# Altium project Muladhara_PCB.PrjPcb
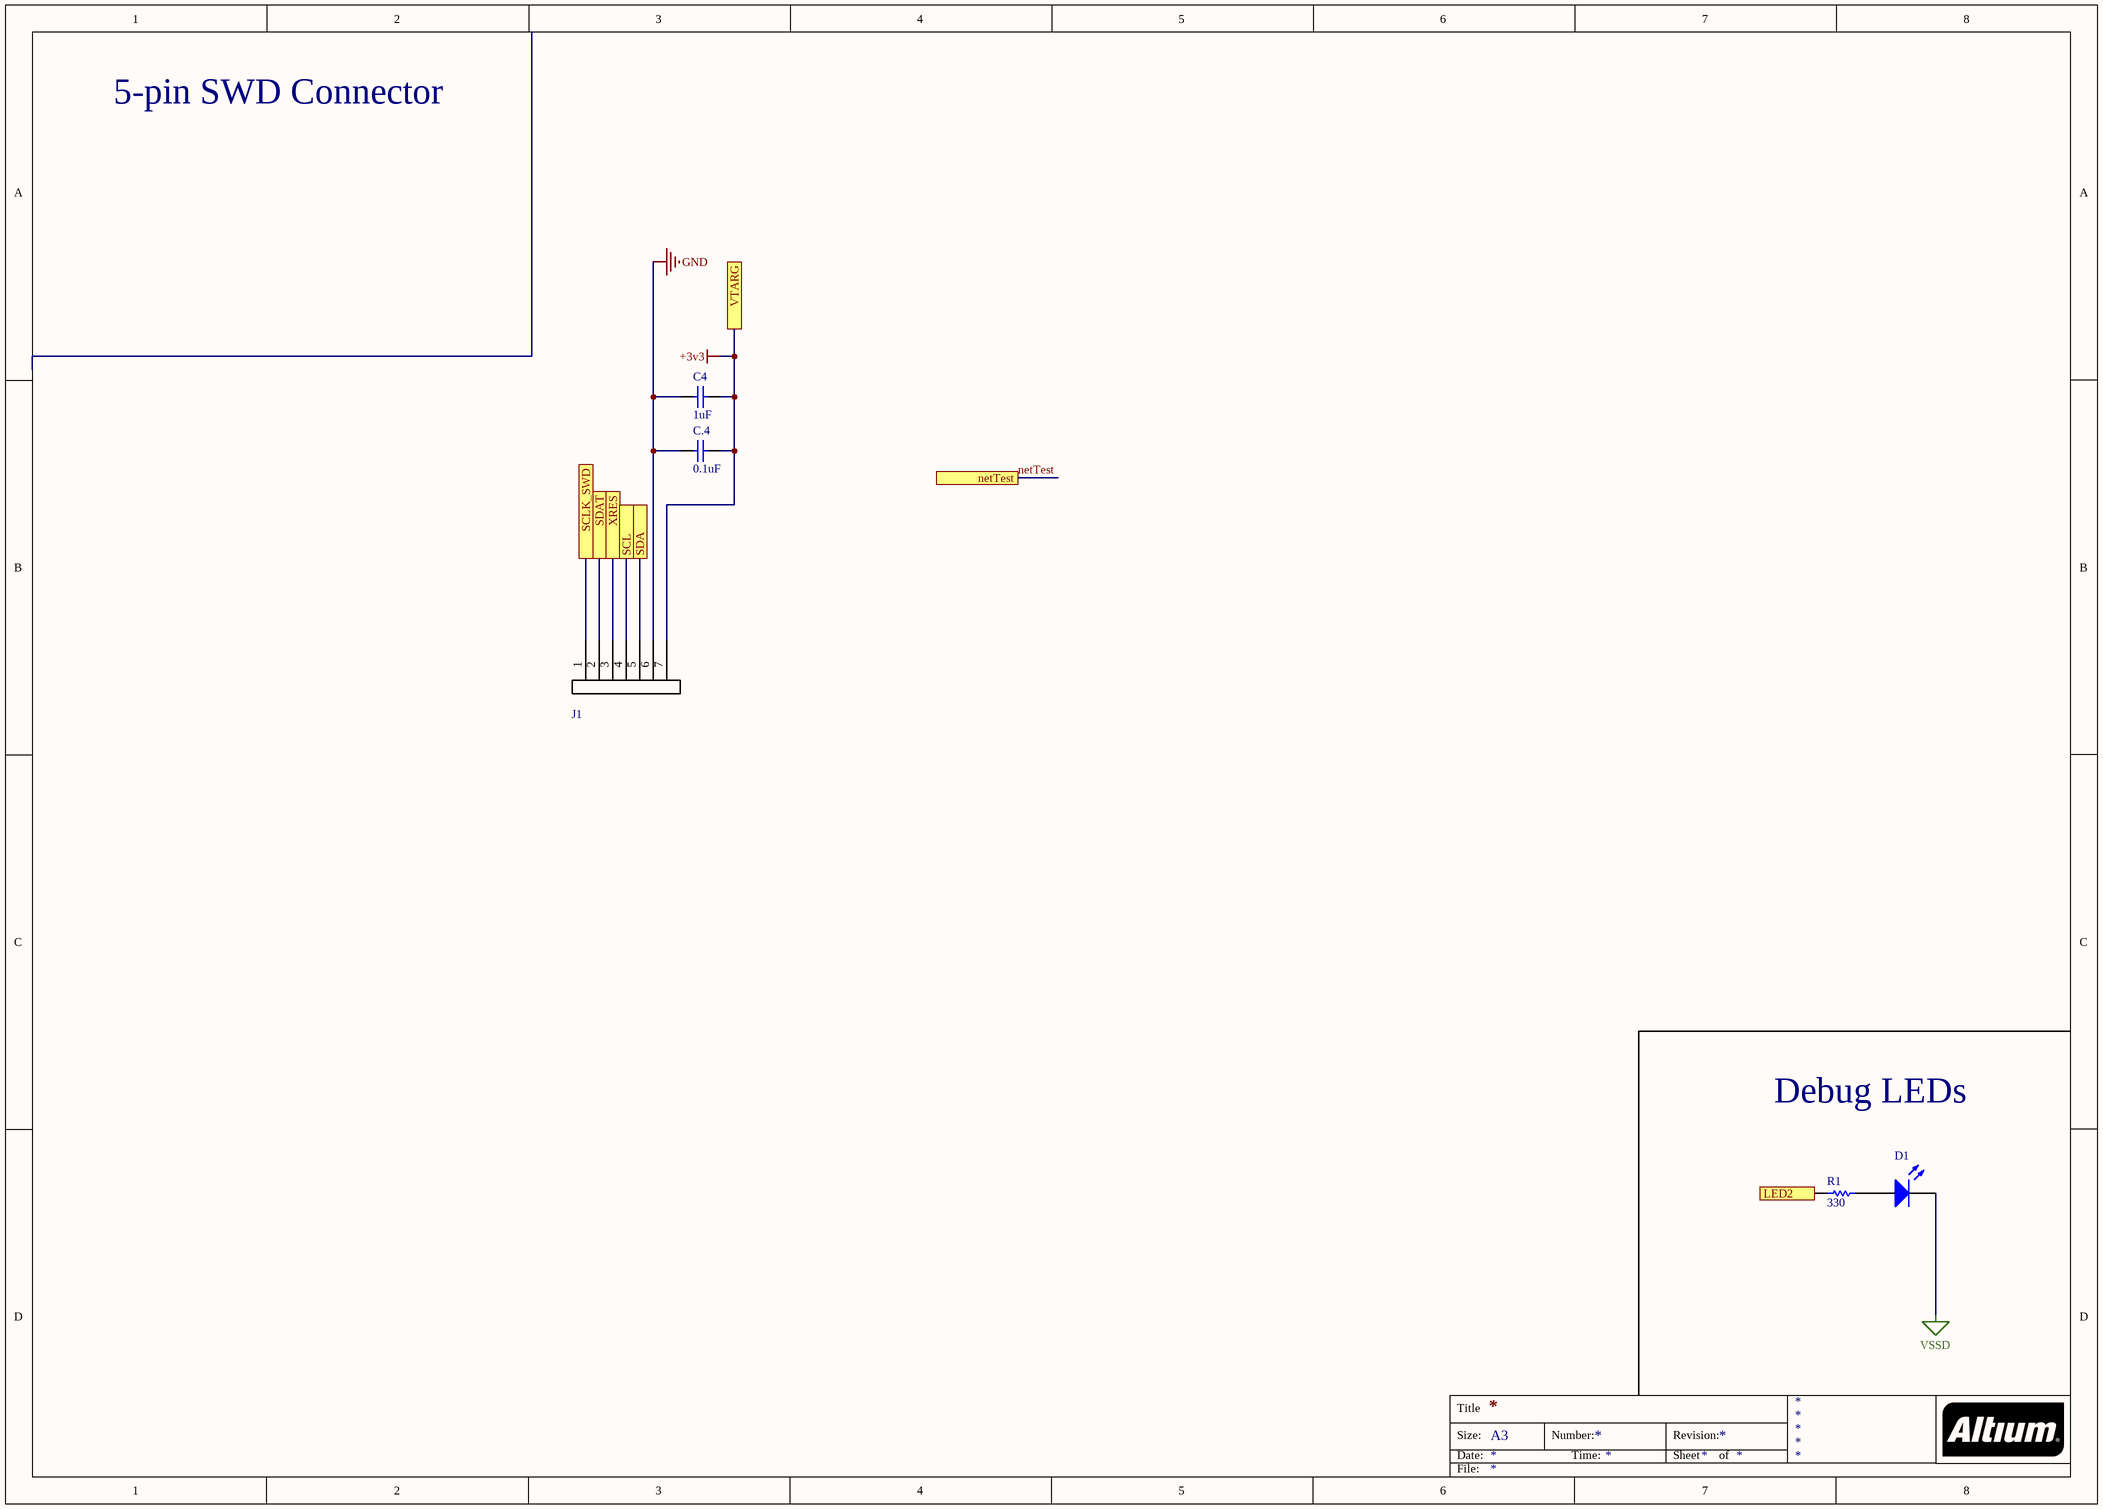
[diagram p0: Comm.SchDoc]
4 sheets, 35 parts. Net scope: flat (ports and power ports of the same name join across sheets).
Board file: Muladhara_Circuit.PcbDoc
Sheets:
  Comm.SchDoc
  CSX_Capsense.SchDoc
  CY8C4125AZI-S433.SchDoc
  Power.SchDoc

## Sheet Comm.SchDoc
size A3

### Parts
C4  1uF  [CAPC0603(1608)100_N]
C.4  0.1uF  [CAPC0603(1608)100_N]
D1  150060BS75000  [0603_A]  (value not drawn)
J1  BM07B-NSHSS-TBT (LF)(SN)  [BM07B-NSHSS-TBT (LF)(SN)]  (value not drawn)
R1  330  [RESC0603(1608)_L]

### Ports
LED2 (in), netTest, SCL, SCLK_SWD, SDA, SDAT, VTARG, XRES

### Nets
+3v3: C4.1 C.4.1 J1.7 ; port VTARG
GND: C4.2 C.4.2 J1.6
VSSD: D1.1(K)
LED2: R1.1 ; port LED2
netTest: port netTest
SCL: J1.4 ; port SCL
SCLK_SWD: J1.1 ; port SCLK_SWD
SDA: J1.5 ; port SDA
SDAT: J1.2 ; port SDAT
XRES: J1.3 ; port XRES
NetD1_2: D1.2(A) R1.2

### Notes on the sheet
- 5-pin SWD Connector
- Debug LEDs
- Title
- Size:
- Date:
- A3
- Number:
- Time:
- Revision:
- Sheet
- of
- File:

### Library data of the parts
C4 = CMP-1035-02746-1: CAP 1uF 50V ±20% 0603 (1608 Metric) Thickness 1mm SMD; Tolerance: Â±20%; Case-EIA: 0603; Case-Metric: 1608; Value: 1uF; Technology: SMT; Max Thickness: 1 mm; Rated Voltage: 50 V
C.4 = CMP-1035-02746-1: CAP 0.1 uF 50V ±20% 0603 (1608 Metric) Thickness 1mm SMD; Tolerance: Â±20%; Value: 1uF; Case-EIA: 0603; Case-Metric: 1608; Technology: SMT; Max Thickness: 1 mm; Rated Voltage: 50 V
D1 = CMP-1426-00003-1: SMD mono-color Chip LED, WL-SMCW, Blue; Manufacturer: Wuerth Elektronik; Color: Blue; ComponentLink2Description: Datasheet; ComponentLink2URL: http://katalog.we-online.com/led/datasheet/150060BS75000.pdf; ComponentLink1URL: http://www.we-online.com; PackageReference: 0603_A; PartNumber: 150060BS75000; ComponentLink1Description: Manufacturer URL
R1 = CMP-1012-00062-1: 330R 0.1W 5% 0603 (1608 Metric)  SMD; Value: 330.00 Ohm; Case-EIA: 0603; Case-Metric: 1608; Tolerance: 5 %; Power: 0.1 W; Technology: SMT

## Sheet CSX_Capsense.SchDoc
size A3
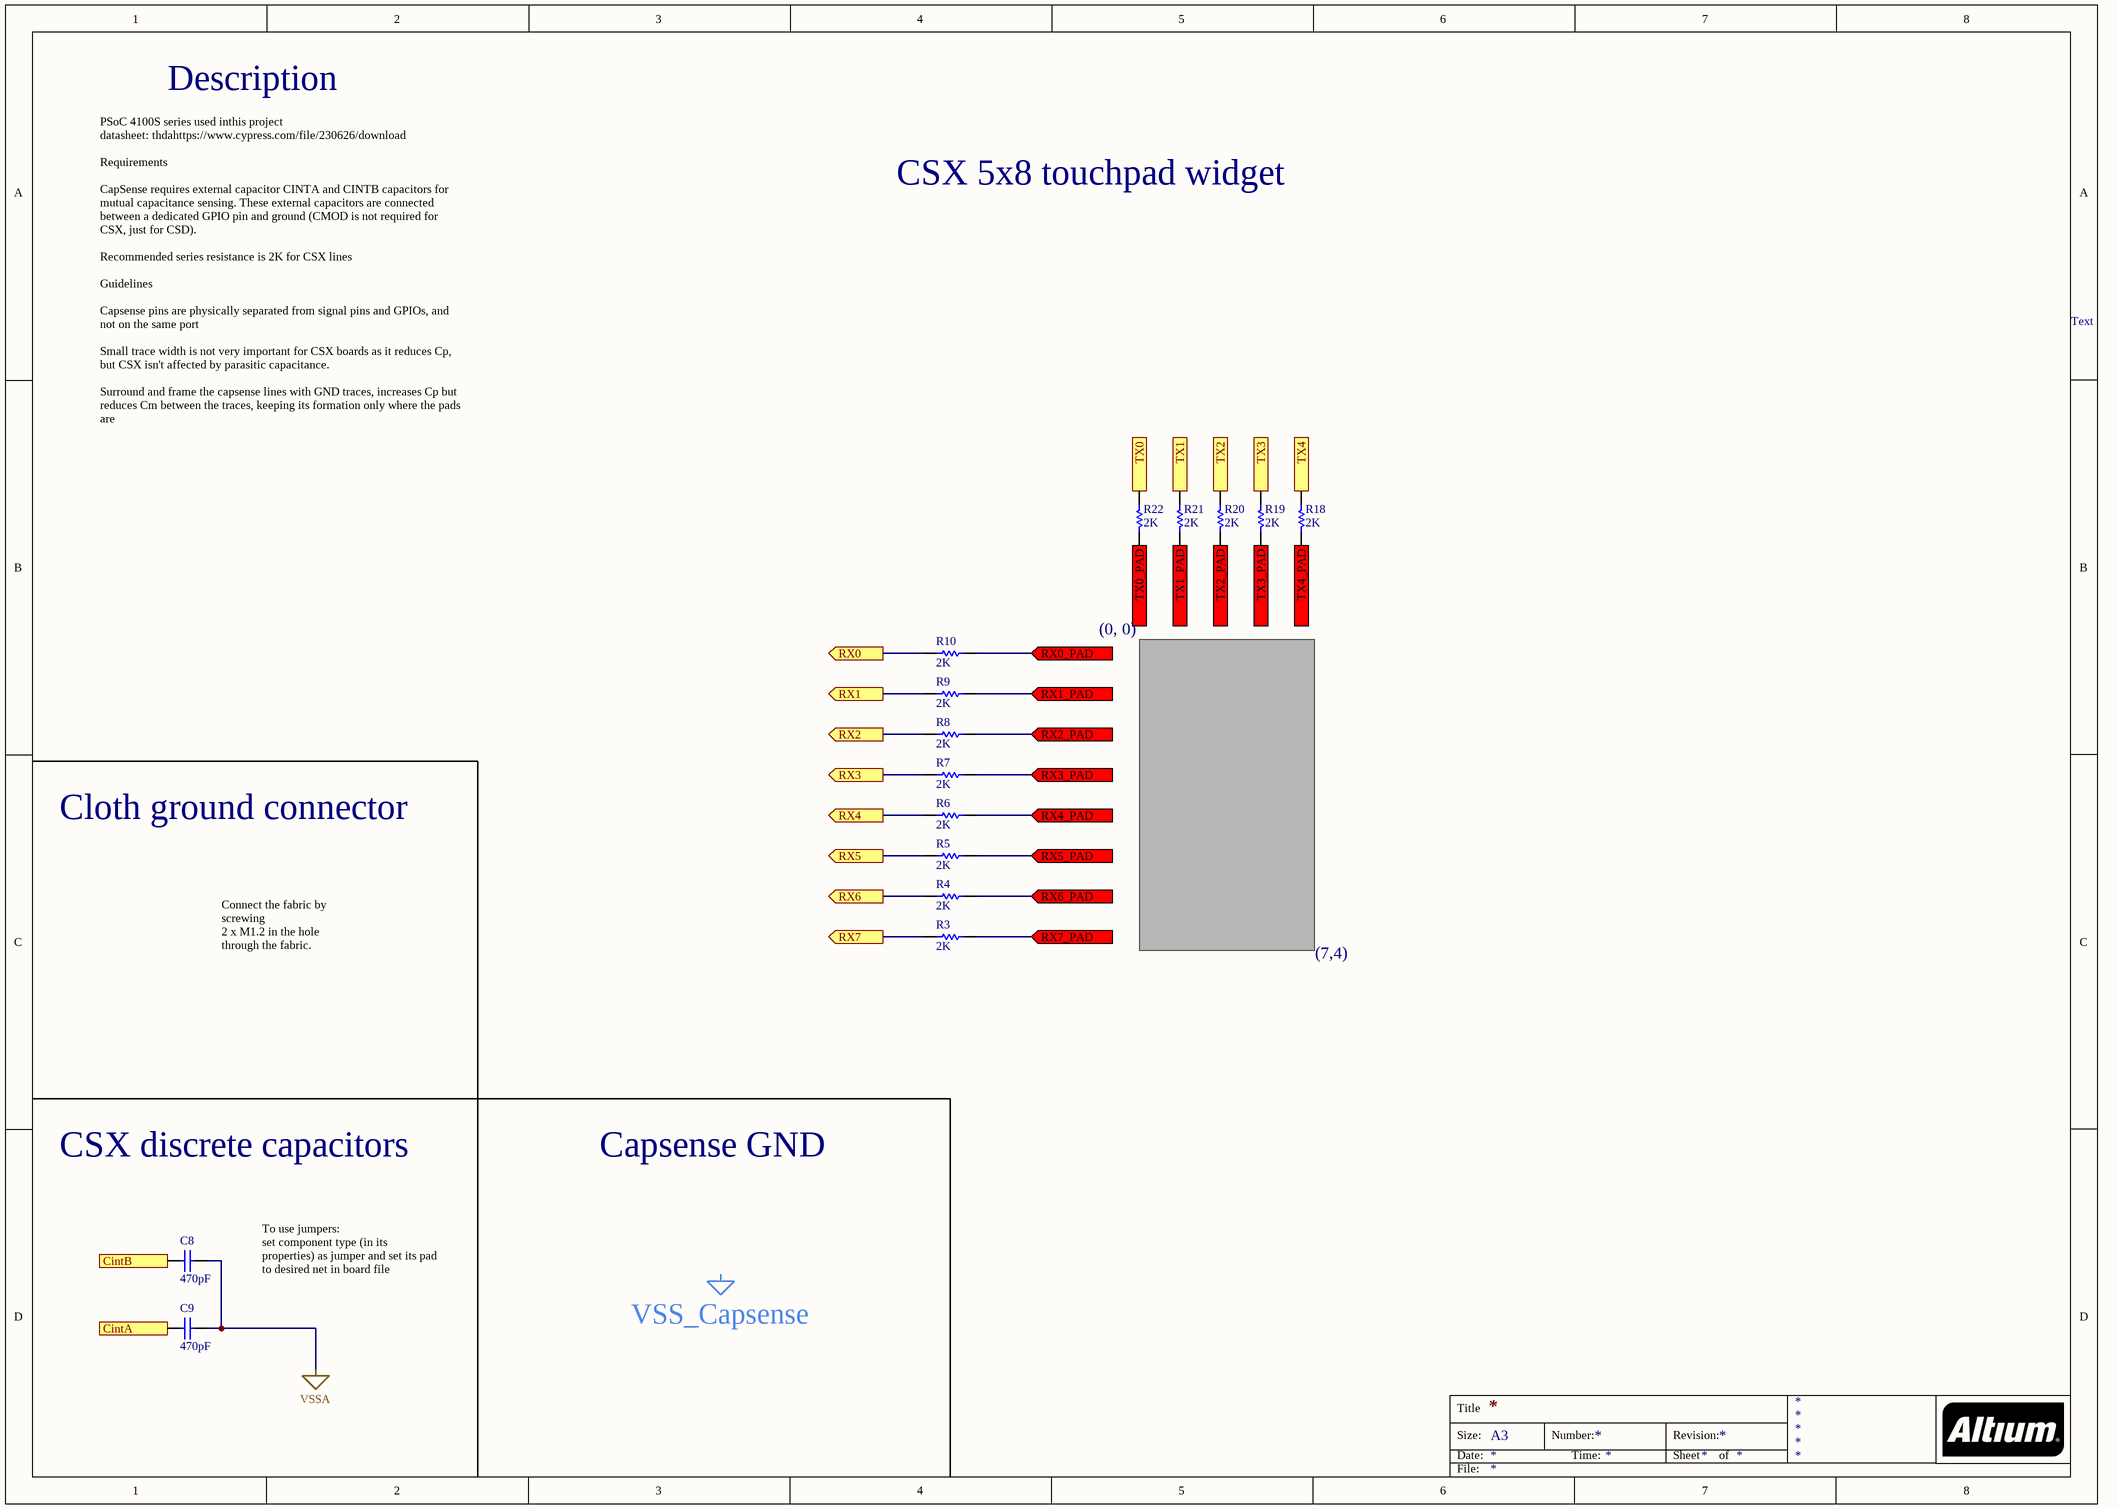
[diagram p1: CSX_Capsense.SchDoc]

### Parts
C8  470pF  [CAPC0603(1608)100_N]
C9  470pF  [CAPC0603(1608)100_N]
R3  2K  [RESC0603(1608)_N]
R4  2K  [RESC0603(1608)_N]
R5  2K  [RESC0603(1608)_N]
R6  2K  [RESC0603(1608)_N]
R7  2K  [RESC0603(1608)_N]
R8  2K  [RESC0603(1608)_N]
R9  2K  [RESC0603(1608)_N]
R10  2K  [RESC0603(1608)_N]
R18  2K  [RESC0603(1608)_N]
R19  2K  [RESC0603(1608)_N]
R20  2K  [RESC0603(1608)_N]
R21  2K  [RESC0603(1608)_N]
R22  2K  [RESC0603(1608)_N]

### Ports
CintA, CintB, RX0 (out), RX0_PAD (in), RX1 (out), RX1_PAD (in), RX2 (out), RX2_PAD (in), RX3 (out), RX3_PAD (in), RX4 (out), RX4_PAD (in), RX5 (out), RX5_PAD (in), RX6 (out), RX6_PAD (in), RX7 (out), RX7_PAD (in), TX0 (in), TX0_PAD (out), TX1 (in), TX1_PAD (out), TX2 (in), TX2_PAD (out), TX3 (in), TX3_PAD (out), TX4 (in), TX4_PAD (out)

### Nets
VSSA: C8.2 C9.2
CintA: C9.1 ; port CintA
CintB: C8.1 ; port CintB
RX0: R10.1 ; port RX0
RX0_PAD: R10.2 ; port RX0_PAD
RX1: R9.1 ; port RX1
RX1_PAD: R9.2 ; port RX1_PAD
RX2: R8.1 ; port RX2
RX2_PAD: R8.2 ; port RX2_PAD
RX3: R7.1 ; port RX3
RX3_PAD: R7.2 ; port RX3_PAD
RX4: R6.1 ; port RX4
RX4_PAD: R6.2 ; port RX4_PAD
RX5: R5.1 ; port RX5
RX5_PAD: R5.2 ; port RX5_PAD
RX6: R4.1 ; port RX6
RX6_PAD: R4.2 ; port RX6_PAD
RX7: R3.1 ; port RX7
RX7_PAD: R3.2 ; port RX7_PAD
TX0: R22.1 ; port TX0
TX0_PAD: R22.2 ; port TX0_PAD
TX1: R21.1 ; port TX1
TX1_PAD: R21.2 ; port TX1_PAD
TX2: R20.1 ; port TX2
TX2_PAD: R20.2 ; port TX2_PAD
TX3: R19.1 ; port TX3
TX3_PAD: R19.2 ; port TX3_PAD
TX4: R18.1 ; port TX4
TX4_PAD: R18.2 ; port TX4_PAD

### Notes on the sheet
- Description
- CSX 5x8 touchpad widget
- Text
- PSoC 4100S series used inthis project
  datasheet: thdahttps://www.cypress.com/file/230626/download
  Requirements
  CapSense requires external capacitor CINTA and CINTB capacitors for mutual capacitance sensing. These external capacitors are connected between a dedicated GPIO pin and ground (CMOD is not required for CSX, just for CSD).
  Recommended series resistance is 2K for CSX lines
  Guidelines
  Capsense pins are physically separated from signal pins and GPIOs, and not on the same port
  Small trace width is not very important for CSX boards as it reduces Cp, but CSX isn't affected by parasitic capacitance.
  Surround and frame the capsense lines with GND traces, increases Cp but reduces Cm between the traces, keeping its formation only where the pads are
- (0, 0)
- Cloth ground connector
- Connect the fabric by screwing
  2 x M1.2 in the hole through the fabric.
- (7,4)
- CSX discrete capacitors
- Capsense GND
- To use jumpers:
  set component type (in its properties) as jumper and set its pad to desired net in board file
- Labels drawn without touching a wire or pin: VSS_Capsense
- Title
- Size:
- Date:
- A3
- Number:
- Time:
- Revision:
- Sheet
- of
- File:

### Library data of the parts
C8 C9 = CMP-1035-01661-1: CAP 470pF 10V ±10% 0603 (1608 Metric) Thickness 1mm SMD; Case-EIA: 0603; Tolerance: Â±10%; Case-Metric: 1608; Max Thickness: 1 mm; Rated Voltage: 10 V; Technology: SMT; Value: 470pF
R3-R10 R18-R22 = CMP-1012-00081-1: 2K 0.1W 5% 0603 (1608 Metric)  SMD; Case-Metric: 1608; Value: 2000.00 Ohm; Case-EIA: 0603; Tolerance: 5 %; Technology: SMT; Power: 0.1 W

## Sheet CY8C4125AZI-S433.SchDoc: CY8C4125AZI-S433
size A3
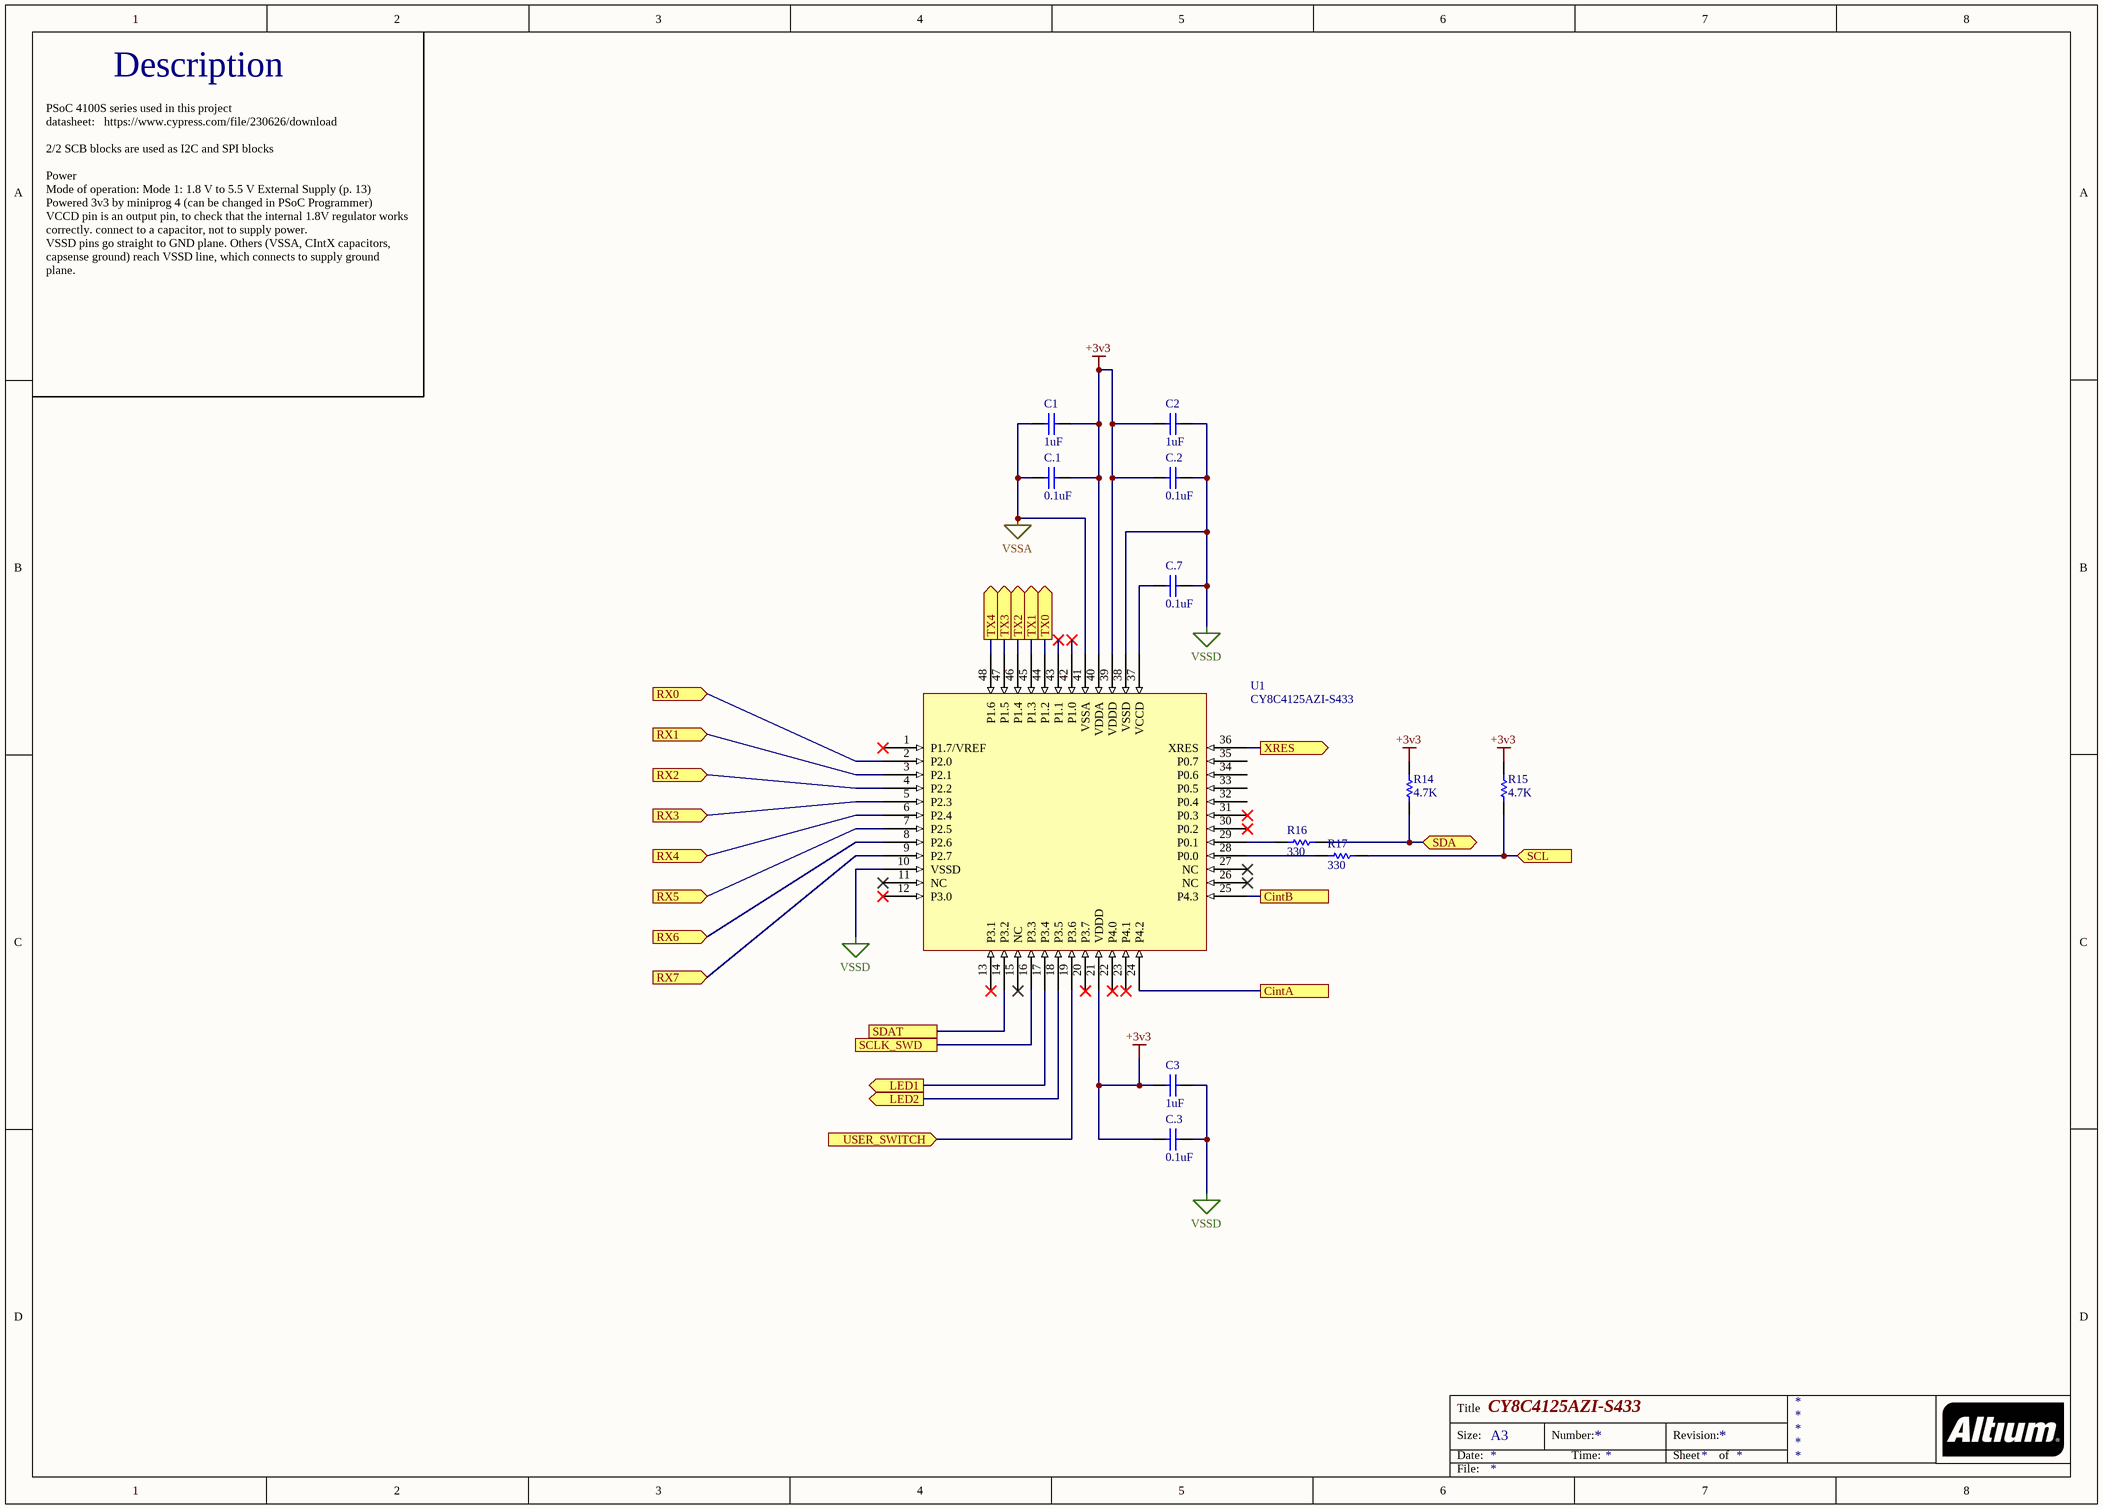
[diagram p2: CY8C4125AZI-S433.SchDoc]

### Parts
C1  1uF  [CAPC0603(1608)100_N]
C2  1uF  [CAPC0603(1608)100_N]
C3  1uF  [CAPC0603(1608)100_N]
C.1  0.1uF  [CAPC0603(1608)100_N]
C.2  0.1uF  [CAPC0603(1608)100_N]
C.3  0.1uF  [CAPC0603(1608)100_N]
C.7  0.1uF  [CAPC0603(1608)100_N]
R14  4.7K  [RESC1608X55X25ML10T15]
R15  4.7K  [RESC1608X55X25ML10T15]
R16  330  [RESC0603(1608)_L]
R17  330  [RESC0603(1608)_L]
U1  CY8C4125AZI-S433  [CY8C4125AZI-S433]

### Ports
CintA, CintB, LED1 (out), LED2 (out), RX0 (in), RX1 (in), RX2 (in), RX3 (in), RX4 (in), RX5 (in), RX6 (in), RX7 (in), SCL (in), SCLK_SWD, SDA (bidir), SDAT, TX0 (out), TX1 (out), TX2 (out), TX3 (out), TX4 (out), USER_SWITCH (in), XRES (out)

### Nets
+3v3: C1.2 C2.1 C3.1 C.1.2 C.2.1 C.3.1 R14.2 R15.2 U1.21(VDDD) U1.39(VDDD) U1.40(VDDA)
VSSA: C1.1 C.1.1 U1.41(VSSA)
VSSD: C2.2 C3.2 C.2.2 C.3.2 C.7.2 U1.10(VSSD) U1.38(VSSD)
CintA: U1.24(P4.2) ; port CintA
CintB: U1.25(P4.3) ; port CintB
LED1: U1.17(P3.4) ; port LED1
LED2: U1.18(P3.5) ; port LED2
RX0: U1.2(P2.0) ; port RX0
RX1: U1.3(P2.1) ; port RX1
RX2: U1.4(P2.2) ; port RX2
RX3: U1.5(P2.3) ; port RX3
RX4: U1.6(P2.4) ; port RX4
RX5: U1.7(P2.5) ; port RX5
RX6: U1.8(P2.6) ; port RX6
RX7: U1.9(P2.7) ; port RX7
SCL: R15.1 R17.2 ; port SCL
SCLK_SWD: U1.16(P3.3) ; port SCLK_SWD
SDA: R14.1 R16.2 ; port SDA
SDAT: U1.14(P3.2) ; port SDAT
TX0: U1.44(P1.2) ; port TX0
TX1: U1.45(P1.3) ; port TX1
TX2: U1.46(P1.4) ; port TX2
TX3: U1.47(P1.5) ; port TX3
TX4: U1.48(P1.6) ; port TX4
USER_SWITCH: U1.19(P3.6) ; port USER_SWITCH
XRES: U1.36(XRES) ; port XRES
NetC.7_1: C.7.1 U1.37(VCCD)
NetR16_1: R16.1 U1.29(P0.1)
NetR17_1: R17.1 U1.28(P0.0)

Not connected (* = marked no-connect by the designer): U1 1(P1.7/VREF)* 11(NC)* 12(P3.0)* 13(P3.1)* 15(NC)* 20(P3.7)* 22(P4.0)* 23(P4.1)* 26(NC)* 27(NC)* 30(P0.2)* 31(P0.3)* 32(P0.4) 33(P0.5) 34(P0.6) 35(P0.7) 42(P1.0)* 43(P1.1)*

### Notes on the sheet
- Description
- PSoC 4100S series used in this project
  datasheet:   https://www.cypress.com/file/230626/download
  2/2 SCB blocks are used as I2C and SPI blocks
  Power
  Mode of operation: Mode 1: 1.8 V to 5.5 V External Supply (p. 13)
  Powered 3v3 by miniprog 4 (can be changed in PSoC Programmer)
  VCCD pin is an output pin, to check that the internal 1.8V regulator works correctly. connect to a capacitor, not to supply power.
  VSSD pins go straight to GND plane. Others (VSSA, CIntX capacitors, capsense ground) reach VSSD line, which connects to supply ground plane.
- Title
- Size:
- Date:
- A3
- Number:
- Time:
- Revision:
- Sheet
- of
- File:

### Library data of the parts
C1-C3 = CMP-1035-02746-1: as C4 on sheet Comm; Value: 1uF; Technology: SMT; Max Thickness: 1 mm; Rated Voltage: 50 V
C.1-C.3 C.7 = CMP-1035-02746-1: as C.4 on sheet Comm; Technology: SMT; Max Thickness: 1 mm; Rated Voltage: 50 V
R14 R15 = CMP-2000-05024-1: RC0603JR-074K7L Chip Resistor, 4.7 KOhm, +/- 5%, 100 mW, -55 to 155 degC, 0603 (1608 Metric), RoHS, Tape and Reel; Manufacturer: Yageo; Resistance: 4.7kOhms; Temperature Coefficient: 100PPM/C; Power Rating: 100mW; Voltage Rating: 50V; Operating Temperature Range: -55Cto+155C; Case Code - mm: 1608; Tolerance: 5%; Product: ThickFilmResistorsGeneralPurpose; Case Code - in: 0603; Datasheet URL: http://www.yageo.com/documents/recent/PYu-RC_Group_51_RoHS_L_04.pdf; Package Reference: 603; Datasheet Version: Rev. 4, 02/2016; Package Description: 2-Pin Surface Mount Device, Body 1.6 x 0.8 mm; Manufacturer URL: http://www.yageo.com/; Series: RC; Packaging: Reel; Termination Style: SMD/SMT
R16 R17 = CMP-1012-00062-1: as R1 on sheet Comm; Tolerance: 5 %; Power: 0.1 W; Technology: SMT

## Sheet Power.SchDoc
size A4
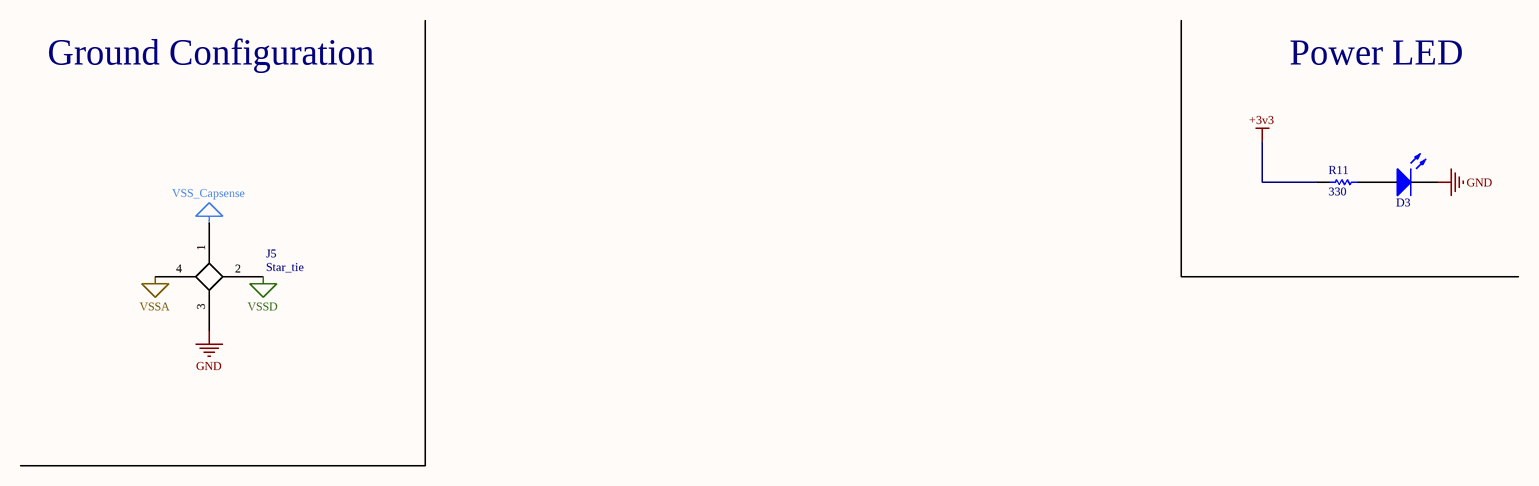
[diagram p3: Power.SchDoc]

### Parts
D3  150060BS75000  [0603_A]  (value not drawn)
J5  Star_tie  [Star_tie]
R11  330  [RESC0603(1608)_L]

### Nets
+3v3: R11.1
GND: D3.1(K) J5.3
VSS_Capsense: J5.1
VSSA: J5.4
VSSD: J5.2
NetD3_2: D3.2(A) R11.2

### Notes on the sheet
- Ground Configuration
- Power LED

### Library data of the parts
D3 = CMP-1426-00003-1: as D1 on sheet Comm; Color: Blue; ComponentLink2Description: Datasheet; ComponentLink2URL: http://katalog.we-online.com/led/datasheet/150060BS75000.pdf; ComponentLink1URL: http://www.we-online.com; PackageReference: 0603_A; PartNumber: 150060BS75000; ComponentLink1Description: Manufacturer URL
R11 = CMP-1012-00062-1: as R1 on sheet Comm; Tolerance: 5 %; Power: 0.1 W; Technology: SMT

## Nets that join several sheets
+3v3: Comm (C4.1 C.4.1 J1.7), CY8C4125AZI-S433 (11 pins), Power (R11.1)
GND: Comm (C4.2 C.4.2 J1.6), Power (D3.1 J5.3)
VSSA: CSX_Capsense (C8.2 C9.2), CY8C4125AZI-S433 (C1.1 C.1.1 U1.41), Power (J5.4)
VSSD: Comm (D1.1), CY8C4125AZI-S433 (7 pins), Power (J5.2)
CintA: CSX_Capsense (C9.1), CY8C4125AZI-S433 (U1.24)
CintB: CSX_Capsense (C8.1), CY8C4125AZI-S433 (U1.25)
LED2: Comm (R1.1), CY8C4125AZI-S433 (U1.18)
RX0: CSX_Capsense (R10.1), CY8C4125AZI-S433 (U1.2)
RX1: CSX_Capsense (R9.1), CY8C4125AZI-S433 (U1.3)
RX2: CSX_Capsense (R8.1), CY8C4125AZI-S433 (U1.4)
RX3: CSX_Capsense (R7.1), CY8C4125AZI-S433 (U1.5)
RX4: CSX_Capsense (R6.1), CY8C4125AZI-S433 (U1.6)
RX5: CSX_Capsense (R5.1), CY8C4125AZI-S433 (U1.7)
RX6: CSX_Capsense (R4.1), CY8C4125AZI-S433 (U1.8)
RX7: CSX_Capsense (R3.1), CY8C4125AZI-S433 (U1.9)
SCL: Comm (J1.4), CY8C4125AZI-S433 (R15.1 R17.2)
SCLK_SWD: Comm (J1.1), CY8C4125AZI-S433 (U1.16)
SDA: Comm (J1.5), CY8C4125AZI-S433 (R14.1 R16.2)
SDAT: Comm (J1.2), CY8C4125AZI-S433 (U1.14)
TX0: CSX_Capsense (R22.1), CY8C4125AZI-S433 (U1.44)
TX1: CSX_Capsense (R21.1), CY8C4125AZI-S433 (U1.45)
TX2: CSX_Capsense (R20.1), CY8C4125AZI-S433 (U1.46)
TX3: CSX_Capsense (R19.1), CY8C4125AZI-S433 (U1.47)
TX4: CSX_Capsense (R18.1), CY8C4125AZI-S433 (U1.48)
XRES: Comm (J1.3), CY8C4125AZI-S433 (U1.36)